# EAGLE design optoCouplerDmb (EAGLE 6.4)
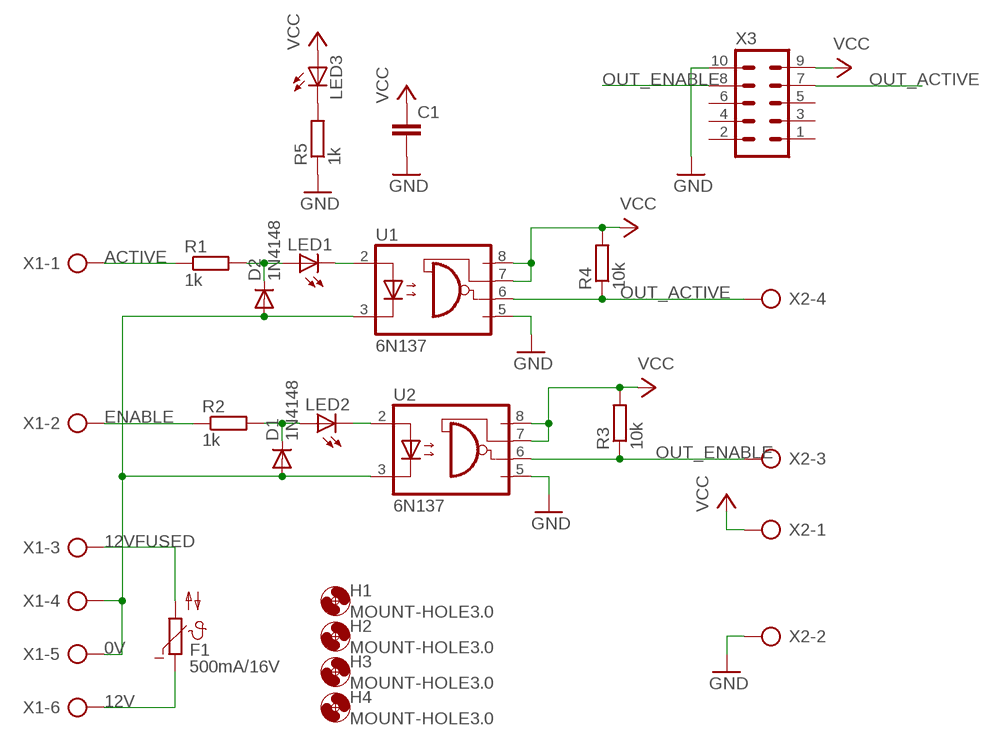
[diagram p0: schematic, sheet 1]

## Parts
C1  C-EU050-030X075  [C050-030X075]
D1  1N4148  1N4148DO35-7  [DO35-7]
D2  1N4148  1N4148DO35-7  [DO35-7]
F1  500mA/16V  B57164  [B57164]
H1  MOUNT-HOLE3.0  [3,0]
H2  MOUNT-HOLE3.0  [3,0]
H3  MOUNT-HOLE3.0  [3,0]
H4  MOUNT-HOLE3.0  [3,0]
LED1  LED3MM  [LED3MM]
LED2  LED3MM  [LED3MM]
LED3  LED3MM  [LED3MM]
R1  1k  R-EU_0207/10  [0207/10]
R2  1k  R-EU_0207/10  [0207/10]
R3  10k  R-EU_0207/10  [0207/10]
R4  10k  R-EU_0207/10  [0207/10]
R5  1k  R-EU_0207/10  [0207/10]
U1  6N137  [DIL08]
U2  6N137  [DIL08]
X1  AK500/6  [AK500/6]
X2  AK500/4  [AK500/4]
X3  ML10  [ML10]

## Nets
0V: D1.A D2.A U1.3(C) U2.3(C) X1.4 X1.5
12V: F1.1 X1.6
12VFUSED: F1.2 X1.3
ACTIVE: R1.1 X1.1
ENABLE: R2.1 X1.2
GND: C1.2 R5.1 U1.5(GND) U2.5(GND) X2.2 X3.10
N$1: D2.C LED1.A R1.2
N$2: LED1.K(C) U1.2(A)
N$3: LED3.K(C) R5.2
N$4: LED2.K(C) U2.2(A)
N$5: D1.C LED2.A R2.2
OUT_ACTIVE: R4.1 U1.6(VO) X2.4 X3.7
OUT_ENABLE: R3.1 U2.6(VO) X2.3 X3.8
VCC: C1.1 LED3.A R3.2 R4.2 U1.7(VE) U1.8(VCC) U2.7(VE) U2.8(VCC) X2.1 X3.9
Unconnected: X3.1 X3.2 X3.3 X3.4 X3.5 X3.6

## Library data of the parts
C1 = rcl:C-EU: CAPACITOR, European symbol
D1 D2 = diode:1N4148: DIODE high speed (Philips)
F1 = ptc-ntc:B57164: SIEMENS NTC; MPN: B57164K474K52; OC_FARNELL: 9753451; OC_NEWARK: 29M3118
H1-H4 = holes:MOUNT-HOLE: MOUNTING HOLE with drill center marker
LED1-LED3 = led:LED: LED OSRAM: - CHIPLED LG R971, LG N971, LY N971, LG Q971, LY Q971, LO R971, LY R971 LH N974, LH R974 LS Q976, LO Q976, LY Q976 LO Q996 - Hyper CHIPLED LW Q18S LB Q993, LB Q99A, LB R99A - SideLED LS A670, LO A670, LY A670, LG A670, LP A670 LB A673, LV A673, LT A673, LW A673 LH A674 LY A675 LS A676, LA A676, LO A676, LY A676, LW A676 LS A679, LY A679, LG A679 - Hyper Micro SIDELED® LS Y876, LA Y876, LO Y876, LY Y876 LT Y87S - SmartLED LW L88C, LW L88S LB L89C, LB L89S, LG L890 LS L89K, LO L89K, LY L89K LS L896, LA L896, LO L896, LY L896 - TOPLED LS T670, LO T670, LY T670, LG T670, LP T670 LSG T670, LSP T670, LSY T670, LOP T670, LYG T670 LG T671, LOG T671, LSG T671 LB T673, LV T673, LT T673, LW T673 LH T674 LS T676, LA T676, LO T676, LY T676, LB T676, LH T676, LSB T676, LW T676 LB T67C, LV T67C, LT T67C, LS T67K, LO T67K, LY T67K, LW E67C LS E67B, LA E67B, LO E67B, LY E67B, LB E67C, LV E67C, LT E67C LW T67C LS T679, LY T679, LG T679 LS T770, LO T770, LY T770, LG T770, LP T770 LB T773, LV T773, LT T773, LW T773 LH T774 LS E675, LA E675, LY E675, LS T675 LS T776, LA T776, LO T776, LY T776, LB T776 LHGB T686 LT T68C, LB T68C - Hyper Mini TOPLED® LB M676 - Mini TOPLED Santana® LG M470 LS M47K, LO M47K, LY M47K Source: http://www.osram.convergy.de LUXEON: - LUMILED® LXK2-PW12-R00, LXK2-PW12-S00, LXK2-PW14-U00, LXK2-PW14-V00 LXK2-PM12-R00, LXK2-PM12-S00, LXK2-PM14-U00 LXK2-PE12-Q00, LXK2-PE12-R00, LXK2-PE12-S00, LXK2-PE14-T00, LXK2-PE14-U00 LXK2-PB12-K00, LXK2-PB12-L00, LXK2-PB12-M00, LXK2-PB14-N00, LXK2-PB14-P00, LXK2-PB14-Q00 LXK2-PR12-L00, LXK2-PR12-M00, LXK2-PR14-Q00, LXK2-PR14-R00 LXK2-PD12-Q00, LXK2-PD12-R00, LXK2-PD12-S00 LXK2-PH12-R00, LXK2-PH12-S00 LXK2-PL12-P00, LXK2-PL12-Q00, LXK2-PL12-R00 Source: www.luxeon.com KINGBRIGHT: KA-3528ASYC Source: www.kingbright.com
R1-R5 = rcl:R-EU_: RESISTOR, European symbol
U1 U2 = optocoupler:6N137: MOTOROLA OPTO COUPLER; MPN: 6N137; OC_FARNELL: 1328376; OC_NEWARK: 52M1895
X1 = con-ptr500:AK500/6: CONNECTOR; OC_FARNELL: unknown; OC_NEWARK: unknown
X2 = con-ptr500:AK500/4: CONNECTOR; OC_FARNELL: unknown; OC_NEWARK: unknown
X3 = con-harting-ml:ML10: HARTING; OC_FARNELL: unknown; OC_NEWARK: unknown

## Board
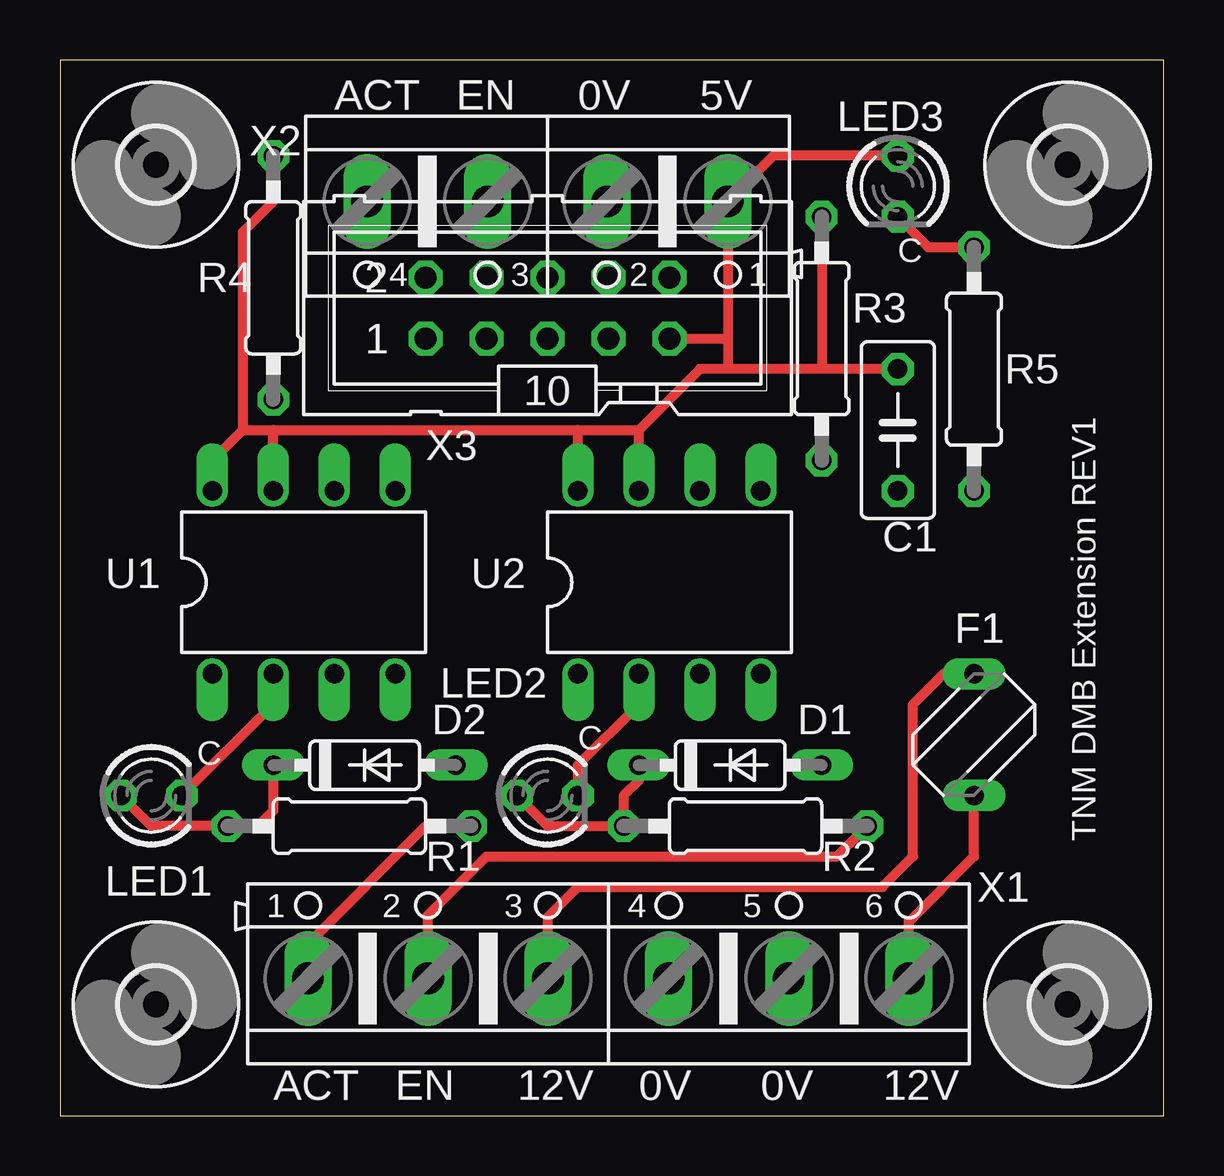
[diagram p1: board, top side]
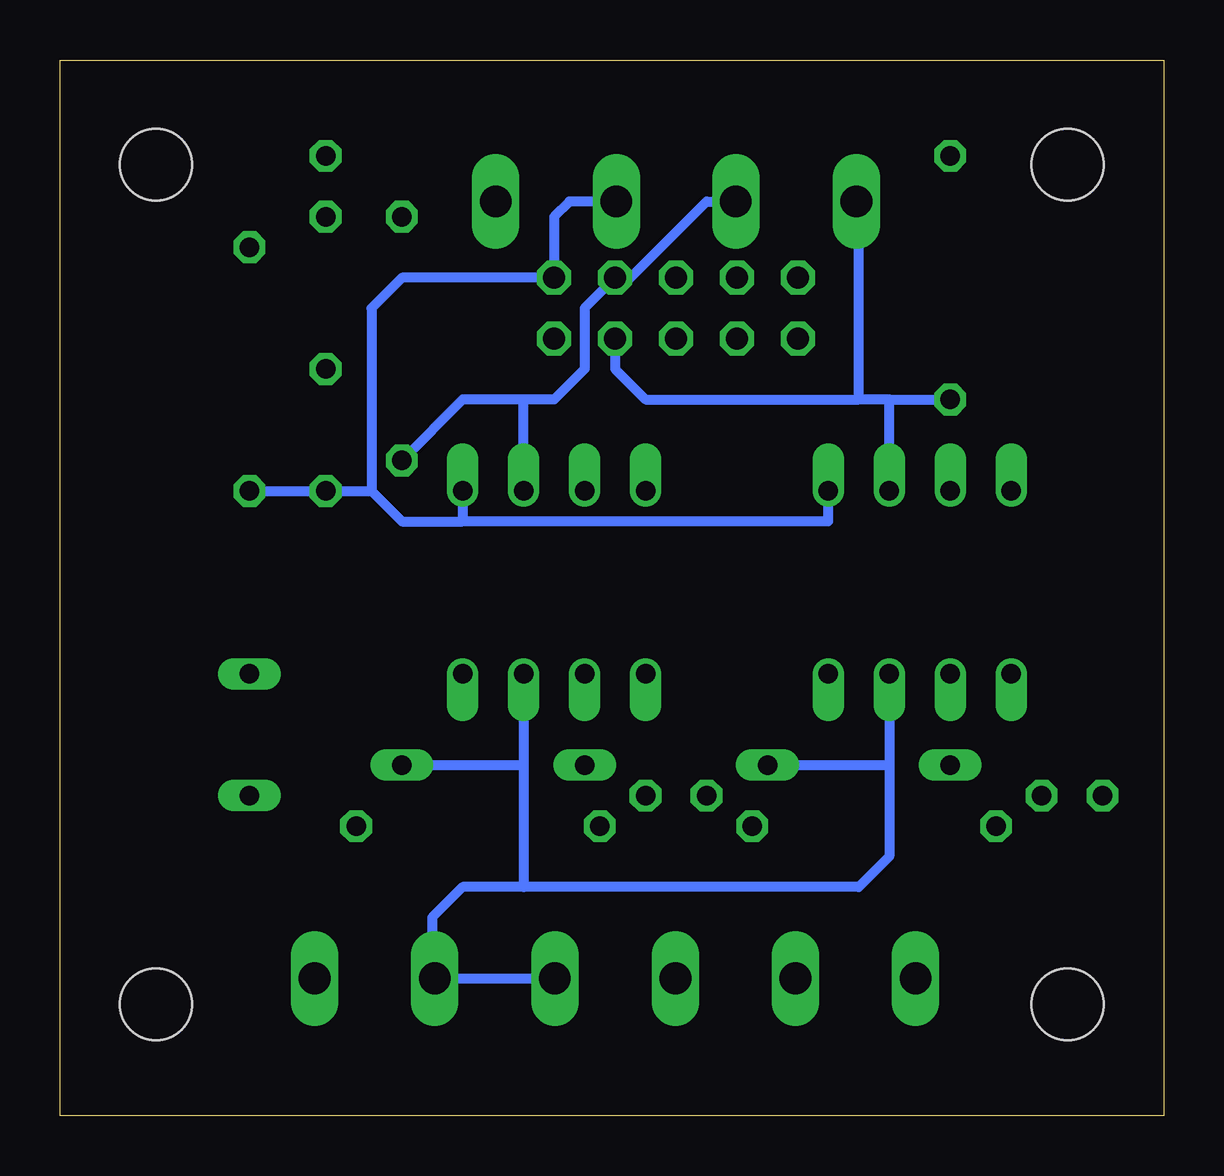
[diagram p2: board, bottom side, seen from below]

Size 46 x 44 mm. Coordinates in mm from the lower left corner, seen from the top.
Outline: 0,0 46,0 46,44 0,44 0,0
Copper layers (1*16): Top 0.035mm / dielectric 1.5mm / Bottom 0.035mm
Design rules "default": minimum track width 10mil, minimum drill 24mil, track to track 8mil, track to pad 8mil, pad to pad 8mil, via to via 8mil, smd to smd 8mil, copper to edge 40mil, drill to drill 8mil, minimum pad ring 10mil, minimum via ring 8mil, stop-mask expansion 4mil, vias tented up to drill 0mil, thermal gap 10mil

### Footprints (pad centres in the part's own frame; a part is rotated, then mirrored left to right if it is on the bottom)
C050-030X075 = drill 0.813 octagon: 1 -2.54,0; 2 2.54,0
DO35-7 = drill 0.813 long: A 3.81,0; C -3.81,0
B57164 = drill 0.813 long: 1 -2.54,0; 2 2.54,0
3,0 = hole 3: 0,0
LED3MM = drill 0.813 octagon: A -1.27,0; K 1.27,0
0207/10 = drill 0.813 octagon: 1 -5.08,0; 2 5.08,0
DIL08 = drill 0.813 offset: 1 -3.81,-3.81; 2 -1.27,-3.81; 3 1.27,-3.81; 4 3.81,-3.81; 5 3.81,3.81; 6 1.27,3.81; 7 -1.27,3.81; 8 -3.81,3.81
AK500/6 = drill 1.321 long: 1 -12.522,0; 2 -7.518,0; 3 -2.515,0; 4 2.515,0; 5 7.518,0; 6 12.522,0
AK500/4 = drill 1.321 long: 1 -7.518,0; 2 -2.489,0; 3 2.489,0; 4 7.518,0
ML10 = drill 0.914 octagon: 1 -5.08,-1.27; 2 -5.08,1.27; 3 -2.54,-1.27; 4 -2.54,1.27; 5 0,-1.27; 6 0,1.27; 7 2.54,-1.27; 8 2.54,1.27; 9 5.08,-1.27; 10 5.08,1.27

### Placement (x,y rotation side)
C1  34.92,28.57 270 top
D1  27.94,14.61 0 top
D2  12.7,14.61 0 top
F1  38.1,15.88 90 top
H1  42,4.63 180 top
H2  4,4.63 0 top
H3  42,39.63 0 top
H4  4,39.63 0 top
LED1  3.81,13.34 0 top
LED2  20.32,13.34 0 top
LED3  34.92,38.73 270 top
R1  12.06,12.06 180 top
R2  28.57,12.06 180 top
R3  31.75,32.38 90 top
R4  8.89,34.92 90 top
R5  38.1,31.11 90 top
U1  10.16,22.23 0 top
U2  25.4,22.23 0 top
X1  22.86,5.71 0 top
X2  20.32,38.1 180 top
X3  20.32,33.66 0 top

### Tracks (layer width: path | path; a pad name or v marks a point on that pad's centre or on a via)
0V
  Bottom 0.406: X1.4 X1.5 30.48,5.82 30.48,8.26 29.21,9.53 26.67,9.53 | U1.3 11.43,14.61 | 11.43,14.61 11.43,10.79 12.7,9.53 26.67,9.53 | U2.3 26.67,14.61 | 26.67,14.61 26.67,9.53 | D1.A 26.67,14.61 | D2.A 11.43,14.61
12V
  Top 0.406: X1.6 35.38,8.08 38.1,10.79 F1.1
12VFUSED
  Top 0.406: X1.3 20.34,8.28 21.59,9.53 34.29,9.53 35.56,10.79 35.56,17.14 36.83,18.41 F1.2
ACTIVE
  Top 0.406: X1.1 10.34,7.16 15.24,12.06 R1.1
ENABLE
  Top 0.406: X1.2 15.34,8.36 17.78,10.79 32.38,10.79 R2.1
GND
  Bottom 0.406: U2.5 29.21,24.77 | 29.21,24.77 13.97,24.77 U1.5 | X2.2 24.77,38.1 25.4,37.47 X3.10 31.75,34.92 33.02,33.66 33.02,26.04 | 33.02,26.04 31.75,24.77 29.21,24.77 | 33.02,26.04 C1.2 R5.1
N$1
  Top 0.406: LED1.A 3.81,12.06 R1.2 8.26,12.06 8.89,12.7 D2.C
N$2
  Top 0.406: LED1.K 8.89,17.14 U1.2
N$3
  Top 0.406: LED3.K 36.2,36.2 R5.2
N$4
  Top 0.406: LED2.K 21.59,14.61 24.13,17.14 U2.2
N$5
  Top 0.406: LED2.A 20.32,12.06 R2.2 23.5,13.34 24.13,13.97 D1.C
OUT_ACTIVE
  Bottom 0.406: U1.6 11.43,29.84 | 11.43,29.84 R4.1 | X3.7 22.86,31.11 21.59,29.84 12.7,29.84 | 12.7,29.84 12.7,38 X2.4 | 11.43,29.84 12.7,29.84
OUT_ENABLE
  Bottom 0.406: U2.6 26.67,29.84 | 26.67,29.84 29.21,29.84 R3.1 | 26.67,29.84 25.4,29.84 24.13,31.11 24.13,33.66 X3.8 22.23,34.92 19.05,38.1 X2.3
VCC
  Top 0.406: 7.62,28.57 6.35,27.3 U1.8 | 7.62,28.57 8.89,28.57 | 8.89,28.57 21.59,28.57 | 21.59,28.57 24.13,28.57 | U2.7 24.13,28.57 | U2.8 21.59,28.57 | U1.7 8.89,28.57 | 7.62,28.57 7.62,36.83 8.89,38.1 R4.2 | C1.1 31.75,31.11 | 31.75,31.11 27.94,31.11 | 27.94,31.11 26.67,31.11 24.13,28.57 | 27.84,32.38 X2.1 29.74,40.01 LED3.A | 27.84,32.38 27.84,31.22 27.94,31.11 | R3.2 31.75,31.11 | X3.9 27.84,32.38

### Text on the board
tNames: ACT | EN | 0V | 5V | C | C | C | TNM DMB Extension REV1 | ACT | EN | 12V | 0V | 0V | 12V